# EAGLE design gyro (EAGLE 7.6.0)
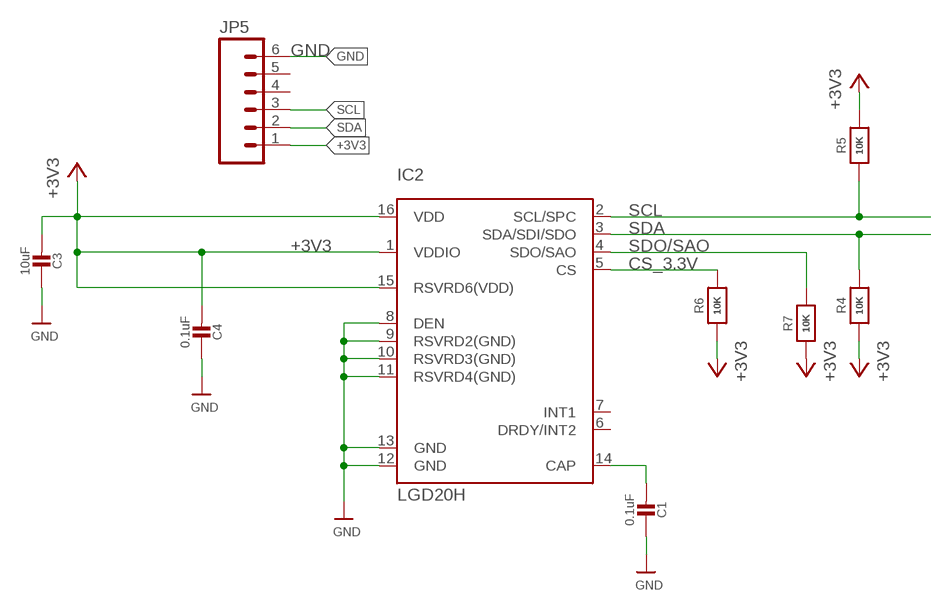
[diagram p0: schematic, sheet 1]

## Parts
C1  0.1uF  CAP_CERAMIC0805-NOOUTLINE  [0805-NO]
C3  10uF  CAP_CERAMIC0805-NOOUTLINE  [0805-NO]
C4  0.1uF  CAP_CERAMIC0805-NOOUTLINE  [0805-NO]
IC2  LGD20H  GYRO_L3GD20H  [L3GD20H_LGA16L]
JP5  M06SIP  [1X06]
R4  10K  RESISTOR0805_NOOUTLINE  [0805-NO]
R5  10K  RESISTOR0805_NOOUTLINE  [0805-NO]
R6  10K  RESISTOR_0805MP  [_0805MP]
R7  10K  RESISTOR0805_NOOUTLINE  [0805-NO]

## Nets
+3V3: C3.2 C4.2 IC2.1(VDDIO) IC2.15(RSVRD6(VDD)) IC2.16(VDD) JP5.1 R4.1 R5.2 R6.1 R7.1
CS_3.3V: IC2.5(CS) R6.2
GND: C1.1 C3.1 C4.1 IC2.8(DEN) IC2.9(RSVRD2(GND)) IC2.10(RSVRD3(GND)) IC2.11(RSVRD4(GND)) IC2.12(GND) IC2.13(GND) JP5.6
N$3: C1.2 IC2.14(CAP)
SCL: IC2.2(SCL/SPC) JP5.3 R5.1
SDA: IC2.3(SDA/SDI/SDO) JP5.2 R4.2
SDO/SAO: IC2.4(SDO/SAO) R7.2
Unconnected: IC2.6(DRDY/INT2) IC2.7(INT1) JP5.4 JP5.5

## Library data of the parts
C1 C3 C4 = microbuilder:CAP_CERAMIC: Ceramic Capacitors For new designs, use the packages preceded by an '_' character since they are more reliable: The following footprints should be used on most boards: _0402 - Standard footprint for regular board layouts _0603 - Standard footprint for regular board layouts _0805 - Standard footprint for regular board layouts _1206 - Standard footprint for regular board layouts For extremely tight-pitch boards where space is at a premium, the following 'micro-pitch' footprints can be used (smaller pads, no silkscreen outline, etc.): _0402MP - Micro-pitch footprint for very dense/compact boards _0603MP - Micro-pitch footprint for very dense/compact boards _0805MP - Micro-pitch footprint for very dense/compact boards _1206MP - Micro-pitch footprint for very dense/compact boards
IC2 = microbuilder:GYRO_L3GD20H: L3GD20H - 3 Axis Gyro
JP5 = SparkFun:M06: Header 6 Standard 6-pin 0.1" header. Use with straight break away headers (SKU : PRT-00116), right angle break away headers (PRT-00553), swiss pins (PRT-00743), machine pins (PRT-00117), and female headers (PRT-00115). Molex polarized connector foot print use with SKU : PRT-08094 with associated crimp pins and housings. NOTES ON THE VARIANTS LOCK and LOCK_LONGPADS... This footprint was designed to help hold the alignment of a through-hole component (i.e. 6-pin header) while soldering it into place. You may notice that each hole has been shifted either up or down by 0.005 of an inch from it's more standard position (which is a perfectly straight line). This slight alteration caused the pins (the squares in the middle) to touch the edges of the holes. Because they are alternating, it causes a "brace" to hold the component in place. 0.005 has proven to be the perfect amount of "off-center" position when using our standard breakaway headers. Although looks a little odd when you look at the bare footprint, once you have a header in there, the alteration is very hard to notice. Also, if you push a header all the way into place, it is covered up entirely on the bottom side. This idea of altering the position of holes to aid alignment will be further integrated into the Sparkfun Library for other footprints. It can help hold any component with 3 or more connection pins.
R4-R7 = microbuilder:RESISTOR: Resistors For new designs, use the packages preceded by an '_' character since they are more reliable: The following footprints should be used on most boards: _0402 - Standard footprint for regular board layouts _0603 - Standard footprint for regular board layouts _0805 - Standard footprint for regular board layouts _1206 - Standard footprint for regular board layouts For extremely tight-pitch boards where space is at a premium, the following 'micro-pitch' footprints can be used (smaller pads, no silkscreen outline, etc.): _0402MP - Micro-pitch footprint for very dense/compact boards _0603MP - Micro-pitch footprint for very dense/compact boards _0805MP - Micro-pitch footprint for very dense/compact boards _1206MP - Micro-pitch footprint for very dense/compact boards

## Board
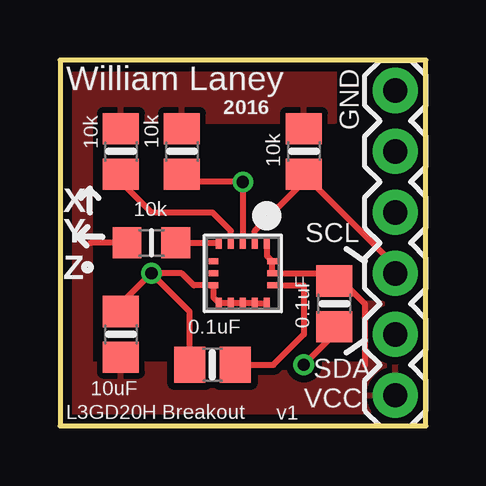
[diagram p1: board, top side]
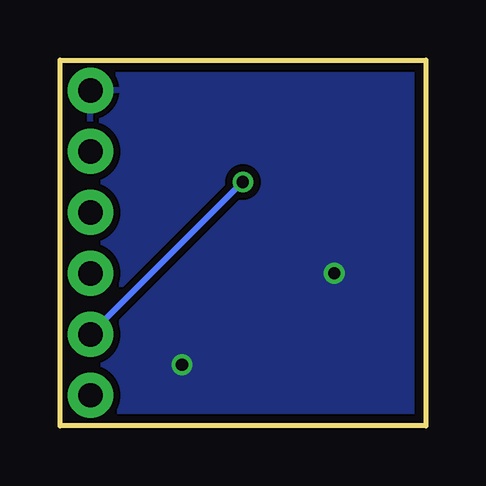
[diagram p2: board, bottom side, seen from below]

Size 15.24 x 15.24 mm. Coordinates in mm from the lower left corner, seen from the top.
Outline: 15.24,15.24 0,15.24 0,0 15.24,0 15.24,15.24
Copper layers (1*16): Top 0.0356mm / dielectric 1.5011mm / Bottom 0.0356mm
Design rules "oshpark-2layer": minimum track width 6mil, minimum drill 13mil, track to track 6mil, track to pad 6mil, pad to pad 6mil, via to via 6mil, smd to smd 6mil, copper to edge 15mil, drill to drill 6mil, minimum pad ring 7mil, minimum via ring 7mil, stop-mask expansion 2.5mil, vias tented up to drill 0mil, thermal gap 10mil

### Footprints (pad centres in the part's own frame; a part is rotated, then mirrored left to right if it is on the bottom)
0805-NO = smd 1.3 x 1.5: 1 -0.95,0; 2 0.95,0
L3GD20H_LGA16L = smd 0.4 x 0.25: 1 -1.225,1; 2 -1.225,0.5; 3 -1.225,0; 4 -1.225,-0.5; 5 -1.225,-1; 9 1.225,-1; 10 1.225,-0.5; 11 1.225,0; 12 1.225,0.5; 13 1.225,1 | smd 0.25 x 0.4: 6 -0.5,-1.225; 7 0,-1.225; 8 0.5,-1.225; 14 0.5,1.225; 15 0,1.225; 16 -0.5,1.225
1X06 = drill 1.016 pad 1.88: 1 0,0; 2 2.54,0; 3 5.08,0; 4 7.62,0; 5 10.16,0; 6 12.7,0
_0805MP = smd 1.2 x 1.3: 1 -1.016,0; 2 1.016,0

### Placement (x,y rotation side)
C1  6.35,2.54 0 top
C3  2.54,3.81 270 top
C4  11.43,5.08 90 top
IC2  7.62,6.35 270 top
JP5  13.97,1.27 90 top
R4  5.08,11.43 270 top
R5  10.16,11.43 90 top
R6  3.81,7.62 0 top
R7  2.54,11.43 270 top

### Tracks (layer width: path | path; a pad name or v marks a point on that pad's centre or on a via)
+3V3
  Top 0.254: IC2.1 8.62,7.08 IC2.16 IC2.15 11.11,6.35 | R6.1 1.27,7.62 | 11.75,6.03 C4.2 11.11,6.35 | 11.11,6.35 11.43,6.35 12.7,5.08 12.7,2.54
  pour Top (isolate 0.305): 11.43,12.7 11.43,15.24 0,15.24 0,0 15.24,0 15.24,5.08 12.7,5.08 12.7,2.54 1.27,2.54 1.27,12.7
CS_3.3V
  Top 0.254: R6.2 6.58,7.62 IC2.5
GND  (via drill 0.51)
  Top 0.254: IC2.13 8.57,5.08 8.17,5.08 IC2.12 IC2.11 IC2.10 IC2.9 6.39,5.35 IC2.8 5.58,5.85 5.08,6.35 v3.81,6.35 | C3.1 2.54,5.08 v3.81,6.35 | C4.1 11.43,3.81 v10.16,2.54 | C1.1 5.4,4.76 v3.81,6.35
  pour Bottom (isolate 0.305): 0,15.24 0,0 15.24,0 15.24,15.24
N$3
  Top 0.254: IC2.14 10.16,5.85 10.16,3.81 8.89,2.54 C1.2
SCL
  Top 0.254: IC2.2 8.12,8.12 10.16,10.16 R5.1 13.97,6.67 JP5.3
SDA  (via drill 0.51)
  Top 0.254: R4.2 5.4,10.16 v7.62,10.16 IC2.3
  Bottom 0.254: JP5.2 v7.62,10.16
SDO/SAO
  Top 0.254: IC2.4 7.12,8.12 6.35,8.89 3.81,8.89 2.54,10.16 R7.2

### Text on the board
tPlace: William Laney | 2016 | 10k | 10k | GND | 10k | X | 10k | Y | SCL | Z | 0.1uF | 0.1uF | SDA | 10uF | VCC | L3GD20H Breakout | v1